# Altium schematic sheet Alimentacion.SchDoc
size A4
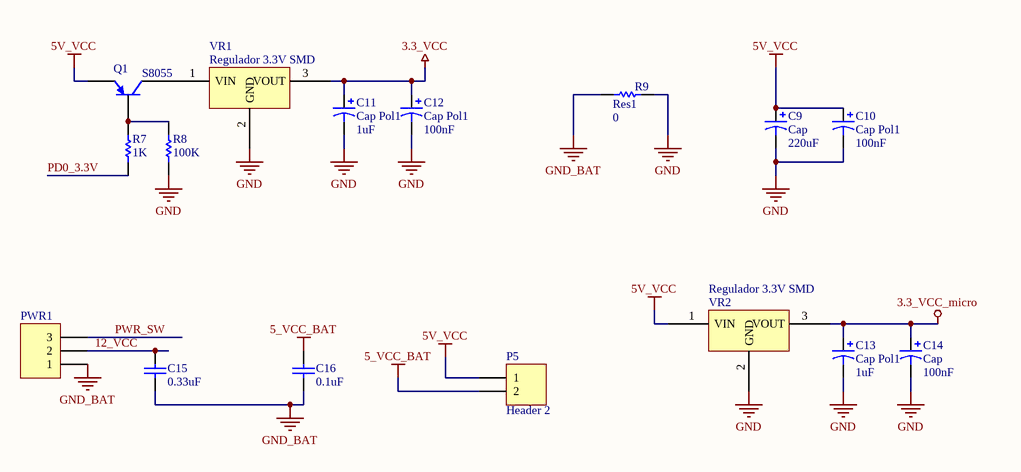
[diagram p0: Alimentacion.SchDoc]

## Parts
C9  Cap  value 220uF  [C0805]
C10  Cap Pol1  value 100nF  [6-0805_L]
C11  Cap Pol1  value 1uF  [C0805]
C12  Cap Pol1  value 100nF  [C0805]
C13  Cap Pol1  value 1uF  [C0805]
C14  Cap  value 100nF  [6-0805_L]
C15  value 0.33uF  [6-0805_L]  (hidden comment: Cap)
C16  value 0.1uF  [C0805]  (hidden comment: Cap)
P5  Header 2  [HDR1X2]
PWR1  Header 3  [HDR1X3]  (value not drawn)
Q1  S8055  [SOT23-3]
R7  value 1K  [C0805]  (hidden comment: Res1)
R8  value 100K  [C0805]  (hidden comment: Res1)
R9  Res1  value 0  [C0805]
VR1  Regulador 3.3V SMD  [SOT223]
VR2  Regulador 3.3V SMD  [SOT223]

## Nets
3.3_VCC: C11.1 C12.1 VR1.3(VOUT)
3.3_VCC_micro: C13.1 C14.1 VR2.3(VOUT)
5_VCC_BAT: C16.2 P5.2
5V_VCC: C9.1 C10.1 P5.1 Q1.2(E) VR2.1(VIN)
GND: C9.2 C10.2 C11.2 C12.2 C13.2 C14.2 R8.1 R9.2 VR1.2(GND) VR2.2(GND)
GND_BAT: C15.1 C16.1 PWR1.1 R9.1
12_VCC: C15.2 PWR1.2
PD0_3.3V: R7.1
PWR_SW: PWR1.3
NetQ1_1: Q1.1(B) R7.2 R8.2
NetQ1_3: Q1.3(C) VR1.1(VIN)

## Library data of the parts
C9-C14 = Cap Pol1: Polarized Capacitor (Radial); Published: 8-Jun-2000; LatestRevisionDate: 17-Jul-2002; LatestRevisionNote: Re-released for DXP Platform.; PackageReference: RB7.6-15; Publisher: Altium Limited; PackageDescription: Polarized Capacitor (Radial); 2 Leads
C15 C16 = Cap: Capacitor; Published: 8-Jun-2000; LatestRevisionDate: 17-Jul-2002; LatestRevisionNote: Re-released for DXP Platform.; PackageReference: RAD-0.3; Publisher: Altium Limited; PackageDescription: Radial Cap, Thru-Hole; 2 Leads; 0.3 in Pin Spacing
P5 = Header 2: Header, 2-Pin; LatestRevisionDate: 17-Jul-2002; LatestRevisionNote: Re-released for DXP Platform.; Publisher: Altium Limited
PWR1 = Header 3: Header, 3-Pin; LatestRevisionDate: 17-Jul-2002; LatestRevisionNote: Re-released for DXP Platform.; Publisher: Altium Limited
Q1 = S8055: PNP SMD General Purpose Amplifier; Published: 8-Jun-2000; LatestRevisionDate: 15-Jan-2003; LatestRevisionNote: PCB Footprint 'BCY-W3/D4.7' replaced; DatasheetVersion: 1997; PackageVersion: Sep-1998; PackageReference: TO-92A; Publisher: Altium Limited; PackageDescription: TO, Flat Index; 3 In-Line, Axial Leads; Body Dia. 4.5mm; Leads 0.51 x 0.48 mm (max); ComponentLink1Description: Manufacturer Link; ComponentLink1URL: http://www.fairchildsemi.com/; ComponentLink2Description: Datasheet; ComponentLink2URL: http://www.fairchildsemi.com/ds/2N%2F2N3906.pdf
R7-R9 = Res1: Resistor; Published: 8-Jun-2000; LatestRevisionDate: 17-Jul-2002; LatestRevisionNote: Re-released for DXP Platform.; PackageReference: AXIAL-0.3; Publisher: Altium Limited; PackageDescription: Axial Device, Thru-Hole; 2 Leads; 0.3 in Pin Spacing
VR1 VR2 = Regulador 3.3V SMD: AMS1117; pin to pad: 1>3 2>1 3>2